# Altium schematic sheet OuputRectif.SchDoc
size A4
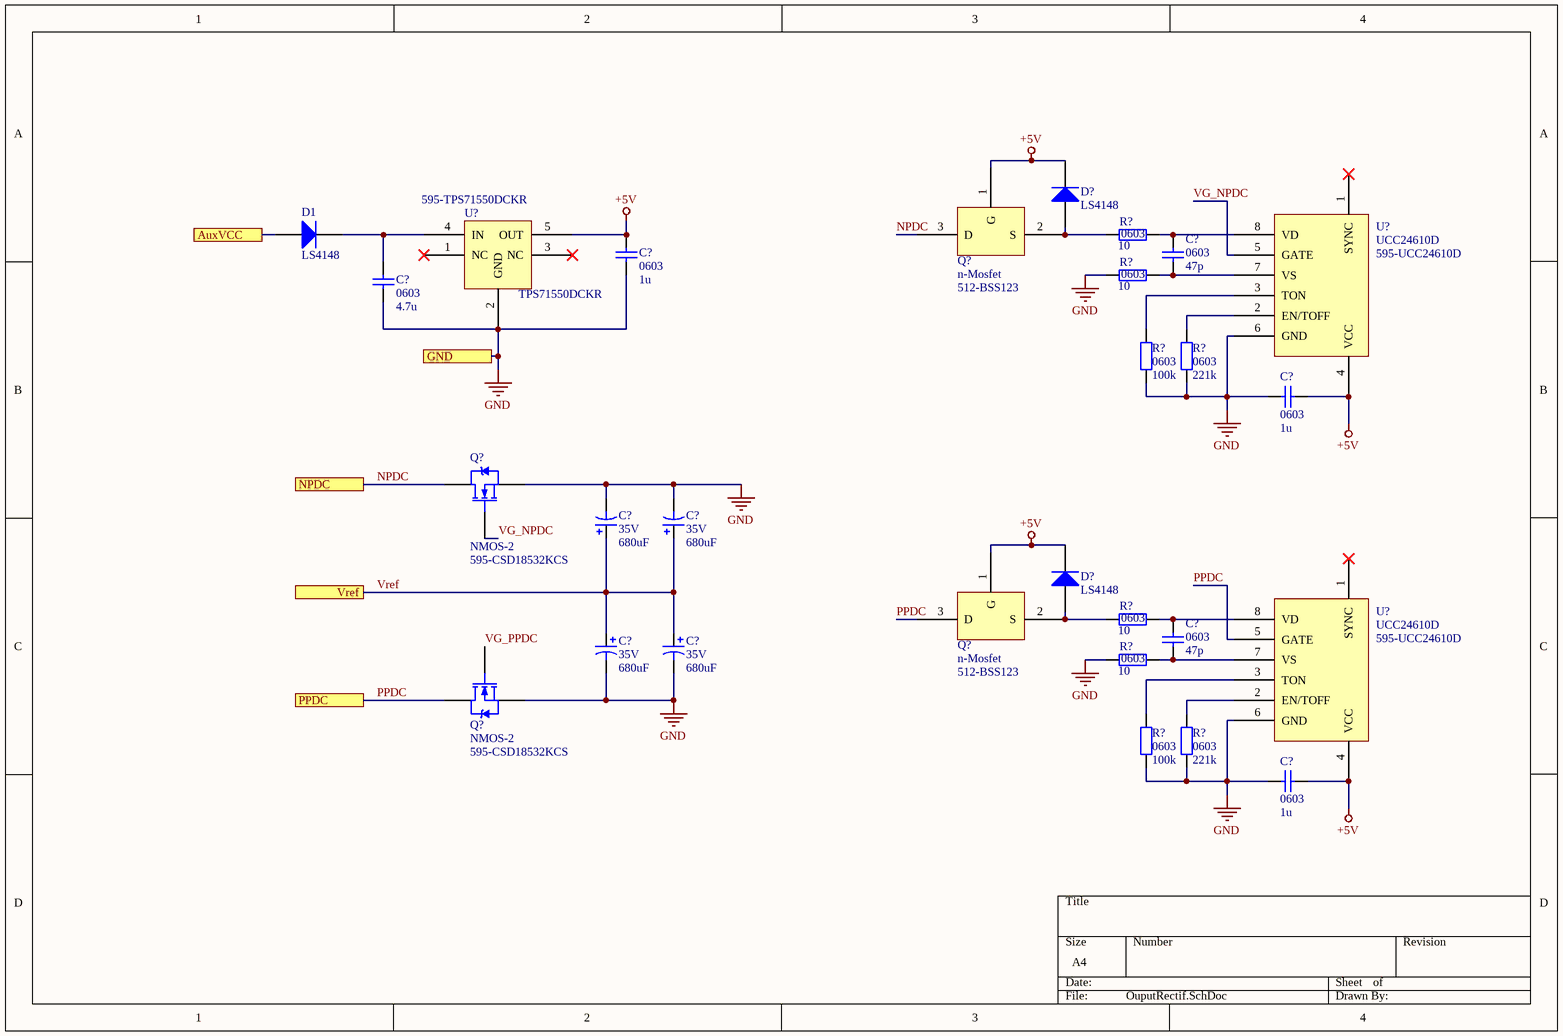
[diagram p0: OuputRectif.SchDoc]

## Parts
(Parts that share a designator on the sheet are numbered #1, #2 ... from top to bottom, then left to right.)
C?#1  0603  value 1u  [1608[0603]]
C?#2  0603  value 47p  [1608[0603]]
C?#3  0603  value 4.7u  [1608[0603]]
C?#4  0603  value 1u  [1608[0603]]
C?#5  35V  value 680uF  [RB7.6-15]
C?#6  35V  value 680uF  [RB7.6-15]
C?#7  0603  value 47p  [1608[0603]]
C?#8  35V  value 680uF  [RB7.6-15]
C?#9  35V  value 680uF  [RB7.6-15]
C?#10  0603  value 1u  [1608[0603]]
D1  LS4148  [SOD-80]
D?#1  LS4148  [SOD-80]
D?#2  LS4148  [SOD-80]
Q?#1  n-Mosfet  Supplier Part Number 1: 512-BSS123  [BSS123]
Q?#2  NMOS-2  Supplier Part Number 1: 595-CSD18532KCS  [TO-220AB]
Q?#3  n-Mosfet  Supplier Part Number 1: 512-BSS123  [BSS123]
Q?#4  NMOS-2  Supplier Part Number 1: 595-CSD18532KCS  [TO-220AB]
R?#1  0603  value 10  [1608[0603]]
R?#2  0603  value 10  [1608[0603]]
R?#3  0603  value 221k  [1608[0603]]
R?#4  0603  value 100k  [1608[0603]]
R?#5  0603  value 10  [1608[0603]]
R?#6  0603  value 10  [1608[0603]]
R?#7  0603  value 221k  [1608[0603]]
R?#8  0603  value 100k  [1608[0603]]
U?#1  TPS71550DCKR  Supplier Part Number 1: 595-TPS71550DCKR  [TPS71550DCKR]
U?#2  UCC24610D  Supplier Part Number 1: 595-UCC24610D  [UCC24610D]
U?#3  UCC24610D  Supplier Part Number 1: 595-UCC24610D  [UCC24610D]

## Ports
AuxVCC, GND, NPDC, PPDC, Vref

## Nets
+5V: C?#1.1 C?#4.1 C?#10.1 D?#1.2(K) D?#2.2(K) Q?#1.1(G) Q?#3.1(G) U?#1.5(OUT) U?#2.4(VCC) U?#3.4(VCC)
GND: C?#1.2 C?#3.2 C?#4.2 C?#5.2 C?#6.2 C?#8.2 C?#9.2 C?#10.2 Q?#2.3(S) Q?#4.3(S) R?#2.1 R?#3.2 R?#4.1 R?#6.1 R?#7.2 R?#8.1 U?#1.2(GND) U?#2.6(GND) U?#3.6(GND) ; port GND
AuxVCC: D1.1(A) ; port AuxVCC
NPDC: Q?#1.3(D) Q?#2.2(D) ; port NPDC
PPDC: Q?#3.3(D) Q?#4.2(D) U?#3.5(GATE) ; port PPDC
VG_NPDC: Q?#2.1(G) U?#2.5(GATE)
VG_PPDC: Q?#4.1(G)
Vref: C?#5.1 C?#6.1 C?#8.1 C?#9.1 ; port Vref
NetC?#2_1: C?#2.1 R?#1.2 U?#2.8(VD)
NetC?#2_2: C?#2.2 R?#2.2 U?#2.7(VS)
NetC?#3_1: C?#3.1 D1.2(K) U?#1.4(IN)
NetC?#7_1: C?#7.1 R?#5.2 U?#3.8(VD)
NetC?#7_2: C?#7.2 R?#6.2 U?#3.7(VS)
NetD?#1_1: D?#1.1(A) Q?#1.2(S) R?#1.1
NetD?#2_1: D?#2.1(A) Q?#3.2(S) R?#5.1
NetR?#3_1: R?#3.1 U?#2.2(EN/TOFF)
NetR?#4_2: R?#4.2 U?#2.3(TON)
NetR?#7_1: R?#7.1 U?#3.2(EN/TOFF)
NetR?#8_2: R?#8.2 U?#3.3(TON)

Not connected (* = marked no-connect by the designer): U?#1 1(NC)* 3(NC)*; U?#2 1(SYNC)*; U?#3 1(SYNC)*

## Library data of the parts
C?#1-C?#4 C?#7 C?#10 = Cap: Capacitor; Published: 8-Jun-2000; LatestRevisionDate: 17-Jul-2002; LatestRevisionNote: Re-released for DXP Platform.; PackageReference: RAD-0.3; Publisher: Altium Limited; PackageDescription: Radial Cap, Thru-Hole; 2 Leads; 0.3 in Pin Spacing; Supplier 1: Digi-Key; Supplier Part Number 1: ECQ-U2A224KL-ND
C?#5 C?#6 C?#8 C?#9 = Cap Pol1: Polarized Capacitor (Radial); Published: 8-Jun-2000; LatestRevisionDate: 17-Jul-2002; LatestRevisionNote: Re-released for DXP Platform.; PackageReference: RB7.6-15; Publisher: Altium Limited; PackageDescription: Polarized Capacitor (Radial); 2 Leads
D1 D?#1 D?#2 = Diode: Default Diode; Published: 8-Jun-2000; LatestRevisionDate: 17-Jul-2002; LatestRevisionNote: Re-released for DXP Platform.; PackageVersion: Sep-1996; PackageReference: SMC; Publisher: Altium Limited; PackageDescription: DO-214-AB/SMC; 2 C-Bend Leads; Body 7.9 x 5.9 mm, inc. leads (LxW); Code_JEDEC: DO-214-AB
Q?#1 Q?#3 = BSS123: Supplier 1: Mouser
Q?#2 Q?#4 = NMOS-2: N-Channel Power MOSFET; Note: Pin 2 is electrically connected to pin 4.; Published: 8-Jun-2000; LatestRevisionDate: 17-Jul-2002; LatestRevisionNote: Re-released for DXP Platform.; DatasheetVersion: PD-9.814; PackageVersion: Feb-1997; PackageReference: TO-220AB; Publisher: Altium Limited; PackageDescription: TO, Thru-Hole, Vertical, Heatsink Mounted; 3 In-Line Leads; Pitch 2.54 mm; ComponentLink1Description: Manufacturer Link; ComponentLink1URL: http://www.irf.com/; Supplier 1: Mouser
R?#1-R?#8 = Res2: Resistor; Published: 8-Jun-2000; LatestRevisionDate: 17-Jul-2002; LatestRevisionNote: Re-released for DXP Platform.; PackageReference: AXIAL-0.4; Publisher: Altium Limited; PackageDescription: Axial Device, Thru-Hole; 2 Leads; 0.4 in Pin Spacing; Supplier 1: Digi-Key; Supplier Part Number 1: 541-220KFDKR-ND
U?#1 = TPS71550DCKR: Supplier 1: Mouser
U?#2 U?#3 = UCC24610D: Supplier 1: Mouser